# Altium project PV Refridgerator.PrjPCB (part 3 of 3)

## Sheet Vsense Thermistor.SchDoc: Temperature Sensor (Thermistor)
size A4; Date: 2017-07-12; DocumentNumber: 14; Revision: B; SheetNumber: 14; SheetTotal: 16; DesignedBy: Mike MacKay
Used 6 times, as channels Vsense Thermistor, Vsense Thermistor, Vsense Thermistor, Vsense Thermistor, Vsense Thermistor, Vsense Thermistor. Parts and nets are listed once, with the designators drawn on the sheet.
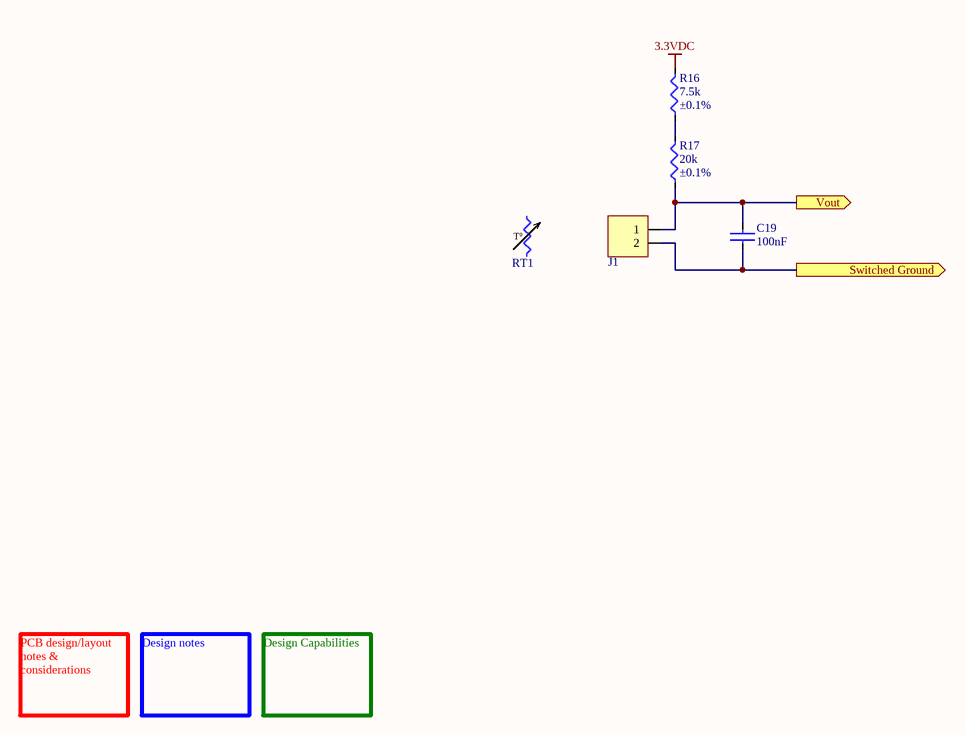
[diagram p16: Vsense Thermistor.SchDoc]

### Parts
C19  Capacitance: 100nF  [C0603 - Ceramic]  (hidden comment: 100nF 0603 50V)
J1  Tº  (value not drawn)
R16  Resistance (Ohms): 7.5k  Tolerance: ±0.1%  [R0603]  (hidden comment: 7.5k 0603 0.1%)
R17  Resistance (Ohms): 20k  Tolerance: ±0.1%  [R0603]  (hidden comment: 20k 0603 0.1%)
RT1  Tº  [Connector - MTA-100 2 Position Friction Lock]  (value not drawn)  (mechanical)

### Ports
Switched Ground (out), Vout (out)

### Nets
3.3VDC: R16.1
Switched Ground: C19.2 J1.2 ; port Switched Ground
Vout: C19.1 J1.1 R17.2 ; port Vout
NetR16_2: R16.2 R17.1

### Channels
Vsense Thermistor: designators end in A; ports Switched Ground=Switched Ground 1 Vout=Vtemp 1
Vsense Thermistor: designators end in B; ports Switched Ground=Switched Ground 2 Vout=Vtemp 2
Vsense Thermistor: designators end in C; ports Switched Ground=Switched Ground 3 Vout=Vtemp 3
Vsense Thermistor: designators end in D; ports Switched Ground=Switched Ground 4 Vout=Vtemp 4
Vsense Thermistor: designators end in E; ports Switched Ground=Switched Ground 5 Vout=Vtemp 5
Vsense Thermistor: designators end in F; ports Switched Ground=Switched Ground 6 Vout=Vtemp 6

### Notes on the sheet
- PCB design/layout notes & considerations
- Design notes
- Design Capabilities
- Repository Version
- BOM/Variant

### Library data of the parts
C19 = 100nF 0603 50V: Manufacturer: Samsung Electro-Mechanics America, Inc; Manufacturer Part Number: CL10B104KB8SFNC; Tolerance: ±10%; Temperature Coefficient: X7R; Value: 100nF 0603 50V; Supplier 1: Digi-Key; RoHS: RoHS Compliant; Category: Capacitors; Stock 1: 1192070; Pricing 1: 1=0.1, 10=0.027, 25=0.0192, 100=0.0125, 500=0.00874, 1000=0.00681 (USD); Packaging: Cut Tape (CT); Voltage - Rated: 50V; Mounting Type: Surface Mount, MLCC; Operating Temperature: -55°C ~ 125°C; Applications: Boardflex Sensitive; Ratings: -; Package / Case: 0603 (1608 Metric); Size / Dimension: 0.063" L x 0.031" W (1.60mm x 0.80mm); Height - Seated (Max): -; Thickness (Max): 0.035" (0.90mm); Lead Spacing: -; Features: Soft Termination; Lead Style: -; ComponentLink1URL: http://www.samsungsem.com/kr/front/downloadcms.do?path=/kr/support/product-search/mlcc/__icsFiles/afieldfile/2014/11/05&fileName=S_CL10B104KB8SFNC.pdf; ComponentLink1Description: http://www.samsungsem.com/kr/front/downloadcms.do?path=/kr/support/product-search/mlcc/__icsFiles/afieldfile/2014/11/05&fileName=S_CL10B104KB8SFNC.pdf; Supplier Part Number 1: 1276-1936-1-ND
J1 = MTA100-2 with friction Lock: Manufacturer: TE Connectivity AMP Connectors; Manufacturer Part Number: 640456-2; Connector Type: Header; Pitch - Mating: 0.100" (2.54mm); Style: Board to Cable/Wire; Shrouding: Shrouded - 1 Wall; Number of Positions: 2; Number of Positions Loaded: All; Contact Length - Mating: 0.295" (7.49mm); Contact Length - Post: 0.140" (3.56mm); Overall Contact Length: 0.535" (13.59mm); Material Flammability Rating: UL94 V-0; Current Rating: Varies by Wire Gauge; Voltage Rating: 250VAC; Value: MTA100-2 with friction Lock; Supplier 1: Digi-Key; Supplier Part Number 1: A1921-ND; RoHS: RoHS Compliant; Category: Connectors, Interconnects; Stock 1: 177276; Pricing 1: 1=0.12, 10=0.117, 50=0.0748, 100=0.0724, 250=0.0624, 500=0.05992, 1000=0.05243, 2500=0.04744 (USD); Packaging: Bulk; Part Status: Active; Operating Temperature: -55°C ~ 105°C; Mounting Type: Through Hole; ComponentLink1URL: http://www.te.com/commerce/DocumentDelivery/DDEController?Action=srchrtrv&DocNm=640456&DocType=Customer+Drawing&DocLang=English; ComponentLink1Description: Spec Sheet; Contact Type: Male Pin; Number of Rows: 1; Row Spacing - Mating: -; Termination: Solder; Fastening Type: Friction Lock; Insulation Height: 0.305" (7.75mm); Contact Shape: Square; Contact Finish - Mating: Tin; Contact Finish Thickness - Mating: -; Contact Finish - Post: Tin; Contact Material: Copper Alloy; Insulation Material: Thermoplastic; Features: -; Ingress Protection: -; Insulation Color: Natural; Mated Stacking Heights: -; Contact Finish Thickness - Post: -; Applications: General Purpose
R16 = 7.5k 0603 0.1%: Resistor; Manufacturer: Yageo; Manufacturer Part Number: RT0603BRD077K5L; Power (Watts): 0.1W, 1/10W; Temperature Coefficient: ±25ppm/°C; Technology: SMT; Value: 7.5k 0603 0.1%; Supplier 1: Digi-Key; Supplier Part Number 1: YAG2311CT-ND; RoHS: RoHS Compliant; Category: Resistors; Stock 1: 15357; Pricing 1: 1=0.32, 10=0.269, 25=0.1952, 50=0.1416, 100=0.105, 250=0.0806, 500=0.0635, 1000=0.04396 (USD); Packaging: Cut Tape (CT); Part Status: Active; Composition: Thin Film; Features: Moisture Resistant; Operating Temperature: -55°C ~ 155°C; Package / Case: 0603 (1608 Metric); Supplier Device Package: 0603; Size / Dimension: 0.063" L x 0.031" W (1.60mm x 0.80mm); Height - Seated (Max): 0.022" (0.55mm); Number of Terminations: 2; Failure Rate: -; ComponentLink1URL: http://www.yageo.com/documents/recent/PYu-RT_1-to-0.05_RoHS_L_7.pdf; ComponentLink1Description: Spec Sheet
R17 = 20k 0603 0.1%: Resistor; Manufacturer: Yageo; Manufacturer Part Number: RT0603BRD0720KL; Power (Watts): 0.1W, 1/10W; Temperature Coefficient: ±25ppm/°C; Technology: SMT; Value: 20k 0603 0.1%; Supplier 1: Digi-Key; Supplier Part Number 1: YAG1582CT-ND; RoHS: RoHS Compliant; Category: Resistors; Stock 1: 24543; Pricing 1: 1=0.35, 10=0.297, 25=0.216, 50=0.1566, 100=0.1161, 250=0.08912, 500=0.0702, 1000=0.0486 (USD); Packaging: Cut Tape (CT); Part Status: Active; Composition: Thin Film; Features: Moisture Resistant; Operating Temperature: -55°C ~ 155°C; Package / Case: 0603 (1608 Metric); Supplier Device Package: 0603; Size / Dimension: 0.063" L x 0.031" W (1.60mm x 0.80mm); Height - Seated (Max): 0.022" (0.55mm); Number of Terminations: 2; Failure Rate: -; ComponentLink1URL: http://www.yageo.com/documents/recent/PYu-RT_1-to-0.05_RoHS_L_7.pdf; ComponentLink1Description: Spec Sheet
RT1 = Thermistor 10k Type J: Resistor; Manufacturer: Murata Electronics North America; Manufacturer Part Number: NXFT15XH103FA2B025; Resistance in Ohms @ 25°C: 10k; Resistance Tolerance: ±1%; B25/50: 3380K; B25/85: 3434K; B25/100: 3455K; Power - Max: 100mW; Value: Thermistor 10k; Supplier 1: Digi-Key; RoHS: RoHS Compliant; Category: Sensors, Transducers; Stock 1: 21226; Pricing 1: 1=0.91, 10=0.752, 25=0.6608, 50=0.549, 100=0.4676, 250=0.42692, 500=0.4066, 1000=0.35578, 2500=0.34053 (USD); Packaging: Bulk; Part Status: Active; Mounting Type: Free Hanging; Operating Temperature: -40°C ~ 125°C; ComponentLink1URL: http://www.murata.com/~/media/webrenewal/support/library/catalog/products/thermistor/ntc/r44e.ashx; ComponentLink1Description: Spec Sheet; Supplier Part Number 1: 490-5628-ND; Technology: THT; B Value Tolerance: ±1%; B0/50: -; B25/75: -; Length - Lead Wire: -; Package / Case: Bead

## Sheet Current Sense.SchDoc: Vsense from 0 to 69.3V
size A4; Date: 2017-02-08; DocumentNumber: 15; Revision: A; SheetNumber: 15; SheetTotal: 16; DesignedBy: Mike MacKay
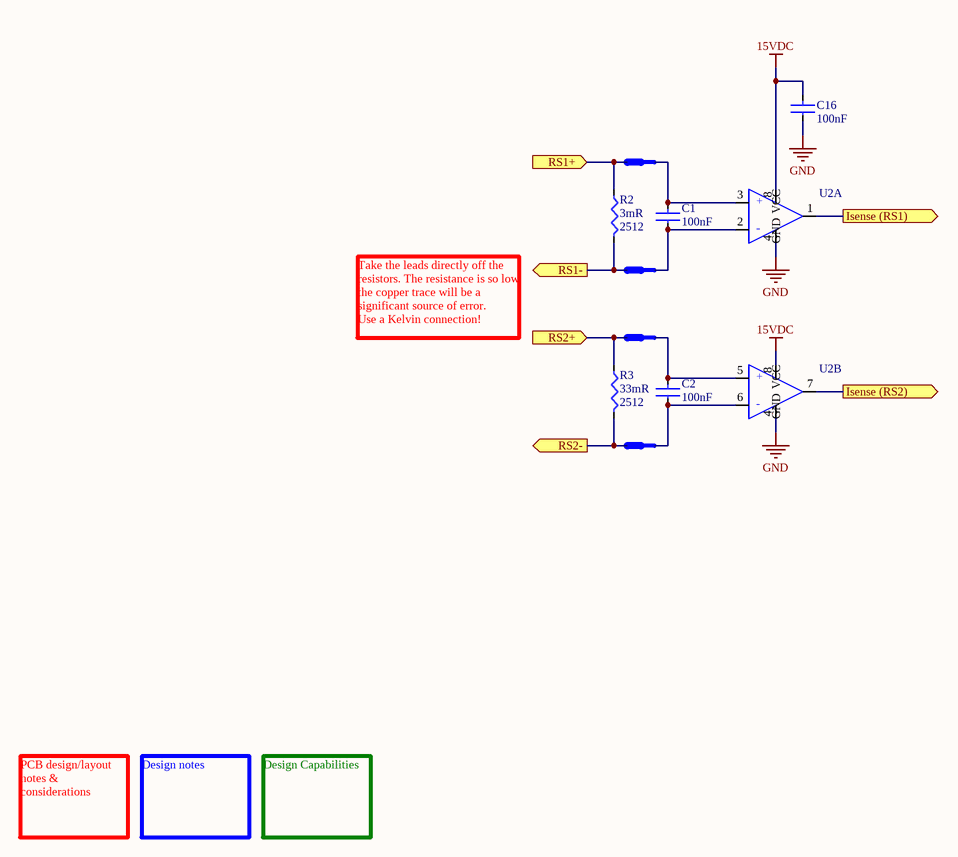
[diagram p17: Current Sense.SchDoc]

### Parts
(Parts that share a designator on the sheet are numbered #1, #2 ... from top to bottom, then left to right.)
C1  Capacitance: 100nF  [C0603 - Ceramic]  (hidden comment: 100nF 0603 50V)
C2  Capacitance: 100nF  [C0603 - Ceramic]  (hidden comment: 100nF 0603 50V)
C16#2  Capacitance: 100nF  [C0603 - Ceramic]  (hidden comment: 100nF 0603 50V)
NetTie3  Net Tie - Different Sizes  (value not drawn)  (net tie, no BOM)
NetTie4  Net Tie - Different Sizes  (value not drawn)  (net tie, no BOM)
NetTie5  Net Tie - Different Sizes  (value not drawn)  (net tie, no BOM)
NetTie6  Net Tie - Different Sizes  (value not drawn)  (net tie, no BOM)
R2  Resistance (Ohms): 3mR  Supplier Device Package: 2512  [R2512]  (hidden comment: 3mR 2512 1%)
R3  Resistance (Ohms): 33mR  Supplier Device Package: 2512  [R2512]  (hidden comment: 33mR 2512 1%)
U2  Dual High Side Current Sense Amplifier  [SOIC-8 (3.9mm)]  (value not drawn)  (parts A,B of 2)

### Ports
Isense (RS1) (out), Isense (RS2) (out), RS1+ (in), RS1- (out), RS2+ (in), RS2- (out)

### Nets
15VDC: C16#2.1 U2.8(VCC)
GND: C16#2.2 U2.4(GND)
HVGND: NetTie6.2 R3.1 ; port RS2-
-Vsolar: NetTie4.2 R2.1 ; port RS1-
Isense (RS1): U2.1(Out) ; port Isense (RS1)
Isense (RS2): U2.7(OUT2) ; port Isense (RS2)
NetC1_1: C1.1 NetTie3.1 U2.3(RS1+)
NetC1_2: C1.2 NetTie4.1 U2.2(RS1-)
NetC2_1: C2.1 NetTie5.1 U2.5(RS2+)
NetC2_2: C2.2 NetTie6.1 U2.6(RS2-)
NetNetTie3_2: NetTie3.2 R2.2 ; port RS1+
NetNetTie5_2: NetTie5.2 R3.2 ; port RS2+

### Notes on the sheet
- Take the leads directly off the resistors. The resistance is so low the copper trace will be a significant source of error.
  Use a Kelvin connection!
- PCB design/layout notes & considerations
- Design notes
- Design Capabilities
- Repository Version
- BOM/Variant
- (in symbol Dual High Side Current Sense Amplifier, part A) +
- (in symbol Dual High Side Current Sense Amplifier, part B) +

### Library data of the parts
C1 C2 C16#2 = 100nF 0603 50V: as C19 on sheet Vsense Thermistor; Value: 100nF 0603 50V; Supplier 1: Digi-Key; RoHS: RoHS Compliant; Category: Capacitors; Stock 1: 1192070; Pricing 1: 1=0.1, 10=0.027, 25=0.0192, 100=0.0125, 500=0.00874, 1000=0.00681 (USD); Packaging: Cut Tape (CT); Voltage - Rated: 50V; Mounting Type: Surface Mount, MLCC; Operating Temperature: -55°C ~ 125°C; Applications: Boardflex Sensitive; Ratings: -; Package / Case: 0603 (1608 Metric); Size / Dimension: 0.063" L x 0.031" W (1.60mm x 0.80mm); Height - Seated (Max): -; Thickness (Max): 0.035" (0.90mm); Lead Spacing: -; Features: Soft Termination; Lead Style: -; ComponentLink1URL: http://www.samsungsem.com/kr/front/downloadcms.do?path=/kr/support/product-search/mlcc/__icsFiles/afieldfile/2014/11/05&fileName=S_CL10B104KB8SFNC.pdf; ComponentLink1Description: http://www.samsungsem.com/kr/front/downloadcms.do?path=/kr/support/product-search/mlcc/__icsFiles/afieldfile/2014/11/05&fileName=S_CL10B104KB8SFNC.pdf; Supplier Part Number 1: 1276-1936-1-ND
NetTie3-NetTie6 = Net Tie - Different Sizes: Ties two nets together
R2 = 3mR 2512 1%: Manufacturer: Yageo; Manufacturer Part Number: PR2512FKF070R003L; Power (Watts): 1W; Temperature Coefficient: ±100ppm/°C; Value: 3mR 2512 1%; Supplier 1: Digi-Key; Supplier Part Number 1: 311-0.003AGCT-ND; RoHS: RoHS Compliant; Category: Resistors; Stock 1: 16866; Pricing 1: 1=0.65, 10=0.544, 25=0.466, 50=0.4196, 100=0.3652, 250=0.32632, 500=0.26416, 1000=0.21366 (USD); Packaging: Cut Tape (CT); Part Status: Active; Tolerance: ±1%; Composition: Thick Film; Features: Current Sense; Operating Temperature: -55°C ~ 170°C; Package / Case: 2512 (6432 Metric); Size / Dimension: 0.252" L x 0.126" W (6.40mm x 3.20mm); Height - Seated (Max): 0.041" (1.03mm); Number of Terminations: 2; Failure Rate: -; ComponentLink1URL: http://www.yageo.com/NewPortal/yageodocoutput?fileName=/pdf/R-Chip/-PYu-PR_51_RoHS_Z_0.pdf; ComponentLink1Description: Spec Sheet
R3 = 33mR 2512 1%: Manufacturer: Yageo; Manufacturer Part Number: RL2512FK-070R033L; Power (Watts): 1W; Temperature Coefficient: ±1200ppm/°C; Value: 3mR 2512 1%; Supplier 1: Digi-Key; Supplier Part Number 1: 311-.033TCT-ND; RoHS: RoHS Compliant; Category: Resistors; Stock 1: 13739; Pricing 1: 1=0.61, 10=0.453, 25=0.3676, 50=0.3196, 100=0.2636, 250=0.229, 500=0.1864, 1000=0.14784 (USD); Packaging: Cut Tape (CT); Part Status: Active; Tolerance: ±1%; Composition: Thick Film; Features: Automotive AEC-Q200, Current Sense, Moisture Resistant; Operating Temperature: -55°C ~ 155°C; Package / Case: 2512 (6432 Metric); Size / Dimension: 0.250" L x 0.126" W (6.35mm x 3.20mm); Height - Seated (Max): 0.026" (0.65mm); Number of Terminations: 2; Failure Rate: -; ComponentLink1URL: http://www.yageo.com/documents/recent/PYu-RL_Group_521_RoHS_L%201.pdf; ComponentLink1Description: http://www.yageo.com/documents/recent/PYu-RL_Group_521_RoHS_L%201.pdf
U2 = Dual High Side Current Sense Amplifier: Manufacturer: Maxim Integrated; Manufacturer Part Number: MAX4377FASA+; Number of Circuits: 2; Slew Rate: 10 V/µs; -3db Bandwidth: 1.7MHz; Current - Input Bias: 800µA; Current - Supply: 1mA; Voltage - Supply, Single/Dual (±): 3 V ~ 28 V; Supplier 1: Digi-Key; RoHS: RoHS Compliant; Category: Integrated Circuits (ICs); Stock 1: 695; Pricing 1: 1=1.98, 10=1.881, 50=1.8742 (USD); Packaging: Tube; Part Status: Active; Amplifier Type: Current Sense; Output Type: -; Gain Bandwidth Product: -; Voltage - Input Offset: -; Current - Output / Channel: -; Operating Temperature: -40°C ~ 125°C; Mounting Type: Surface Mount; Package / Case: 8-SOIC (0.154", 3.90mm Width); Supplier Device Package: 8-SOIC; ComponentLink1URL: https://datasheets.maximintegrated.com/en/ds/MAX4376-MAX4378.pdf; ComponentLink1Description: Spec Sheet; Supplier Part Number 1: MAX4377FASA+-ND

## Sheet Reverse Voltage Protection.SchDoc: Title
size A4; Revision: A; DesignedBy: Craig Comberbach
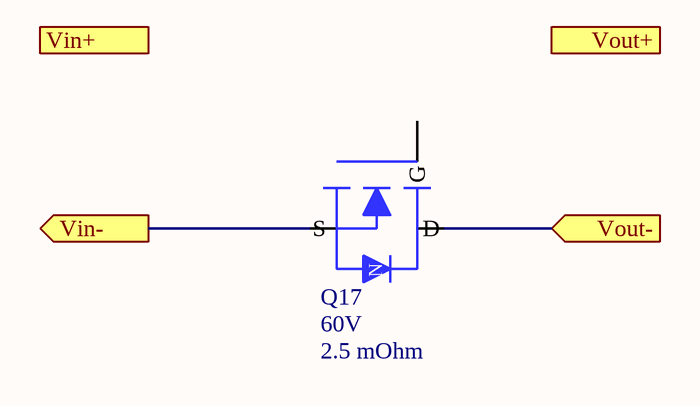
[diagram p18: Reverse Voltage Protection.SchDoc]

### Parts
Q17  Drain to Source Voltage (Vdss): 60V  Rds On (Max) @ Id, Vgs: 2.5 mOhm  [DPAK]  (hidden comment: N-MOSFET)

### Ports
Vin+ (in), Vin- (out), Vout+ (out), Vout- (in)

### Nets
NetQ17_2: Q17.2(D) ; port Vout-
NetQ17_3: Q17.3(S) ; port Vin-

Not connected (* = marked no-connect by the designer): Q17 1(G)

### Notes on the sheet
- Repository Version
- BOM/Variant
- (in symbol N-MOSFET 2.5mR 60V) N

### Library data of the parts
Q17 = N-MOSFET 2.5mR 60V: Manufacturer: Infineon Technologies; Manufacturer Part Number: IPD025N06N; FET Type: N-Channel; Current - Continuous Drain (Id) @ 25°C: 90A; Drive Voltage (Max Rds On,  Min Rds On): 6V, 10V; Vgs(th) (Max) @ Id: 2.8V @ 95µA; Gate Charge (Qg) (Max) @ Vgs: 71nC @ 10V; Input Capacitance (Ciss) (Max) @ Vds: 5200pF @ 30V; Vgs (Max): ±20V; Power Dissipation (Max): 3W (Ta), 167W (Tc); Supplier 1: Digi-Key; Supplier Part Number 1: IPD025N06NCT-ND; RoHS: RoHS Compliant; Category: Discrete Semiconductor Products; Stock 1: 5405; Pricing 1: 1=1.91, 10=1.72, 100=1.3822, 500=1.13558, 1000=0.94091 (USD); Packaging: Cut Tape (CT); Part Status: Active; Technology: MOSFET (Metal Oxide); FET Feature: -; Operating Temperature: -55°C ~ 175°C (TJ); Mounting Type: Surface Mount; Supplier Device Package: PG-TO252-3; Package / Case: TO-252-3, DPak (2 Leads + Tab), SC-63; ComponentLink1URL: http://www.infineon.com/dgdl/IPD025N06N_Rev2+1.pdf?folderId=db3a304313b8b5a60113cee8763b02d7&fileId=db3a304336415dec0136531648062c76; ComponentLink1Description: Spec Sheet; Value: N-MOSFET 2.5mR

## Nets that join several sheets
3.3VDC: High Current H-Bridge/Emergency Thermal Shutdown (D10A.1 R22A.2 Rt3A.2 U4A.5), High Voltage H-Bridge/Emergency Thermal Shutdown (D10B.1 R22B.2 Rt3B.2 U4B.5), 3.3VDC 250mA Linear PS (C12.1 U5.3), Microcontroller (9 pins), ICSP (J5.2 R4.1), Vsense Thermistor (R16A.1), Vsense Thermistor (R16B.1), Vsense Thermistor (R16C.1), Vsense Thermistor (R16D.1), Vsense Thermistor (R16E.1), Vsense Thermistor (R16F.1)
15VDC: High Current H-Bridge/Half H-Bridge Driver (C9A.1 C13A.1 D8A.1 U6A.5), High Current H-Bridge/Half H-Bridge Driver (C9B.1 C13B.1 D8B.1 U6B.5), High Voltage H-Bridge/Half H-Bridge Driver (C9C.1 C13C.1 D8C.1 U6C.5), High Voltage H-Bridge/Half H-Bridge Driver (C9D.1 C13D.1 D8D.1 U6D.5), 15VDC 500mA Boost SMPS (C16#1.2 C20.1 D9.2 R20#1.2), Current Sense (C16#2.1 U2.8)
GND: High Current H-Bridge/Half H-Bridge Driver (C9A.2 C13A.2 U6A.3), High Current H-Bridge/Half H-Bridge Driver (C9B.2 C13B.2 U6B.3), High Current H-Bridge/Emergency Thermal Shutdown (D11A.2 R23A.1 Rb2A.2 U4A.2), High Voltage H-Bridge/Half H-Bridge Driver (C9C.2 C13C.2 U6C.3), High Voltage H-Bridge/Half H-Bridge Driver (C9D.2 C13D.2 U6D.3), High Voltage H-Bridge/Emergency Thermal Shutdown (D11B.2 R23B.1 Rb2B.2 U4B.2), Powersupply (NetTie2.2 NetTie10.1), 15VDC 500mA Boost SMPS (8 pins), 3.3VDC 250mA Linear PS (5 pins), 5VDC 250mA Buck SMPS (13 pins), Microcontroller (9 pins), ICSP (C14.2 J5.3), RGB LED (R8.1 R9.1 R10.1), Vsense 0-69.3V (C17A.2 R20A.1), Current Sense (C16#2.2 U2.4), Vsense (0-69.3V) (C17B.2 R20B.1), Vsense 0-69.3V (C17C.2 R20C.1)
HVGND: Full-Wave Rectifier (5 pins), Powersupply (NetTie2.1), Vsense 0-223 (C18A.2 R15A.1), Current Sense (NetTie6.2 R3.1), Vsense 0-223 (C18B.2 R15B.1), Vsense 0-223 (C18C.2 R15C.1)
+DC Bus: Full-Wave Rectifier (5 pins), High Voltage H-Bridge (Q5.2 Q6.2 Q13.2 Q14.2)
+Vsolar: Overview (J3.1 NetTie7.1), High Current H-Bridge (Q1.2 Q2.2 Q9.2 Q10.2), Powersupply (C25.1 C26.1 C27.1 D?.1)
+VT1.P: Overview (NetTie8.1), High Current H-Bridge (Q1.3 Q3.2 Q9.3 Q11.2), High Current H-Bridge/Half H-Bridge Driver (NetTie1A.1), Transformer (J7.2 T1.8 T1.12)
+VT1.S: Full-Wave Rectifier (D1#1.1 D3.2), Transformer (J8.2 T1.6), Vsense 0-223 (R14A.1)
-Vsolar: Overview (J3.2), Powersupply (C25.2 C26.2 C27.2 NetTie10.2), Current Sense (NetTie4.2 R2.1)
-VT1.P: Overview (NetTie9.1), High Current H-Bridge (Q2.3 Q4.2 Q10.3 Q12.2), High Current H-Bridge/Half H-Bridge Driver (NetTie1B.1), Transformer (J7.1 T1.7 T1.11)
A_HO: High Current H-Bridge (Q1.1 Q9.1), High Current H-Bridge/Half H-Bridge Driver (R12A.2)
A_LO: High Current H-Bridge (Q3.1 Q11.1), High Current H-Bridge/Half H-Bridge Driver (R13A.2)
B_HO: High Current H-Bridge (Q2.1 Q10.1), High Current H-Bridge/Half H-Bridge Driver (R12B.2)
B_LO: High Current H-Bridge (Q4.1 Q12.1), High Current H-Bridge/Half H-Bridge Driver (R13B.2)
C_HO: High Voltage H-Bridge (Q5.1 Q13.1), High Voltage H-Bridge/Half H-Bridge Driver (R12C.2)
C_LO: High Voltage H-Bridge (Q7.1 Q15.1), High Voltage H-Bridge/Half H-Bridge Driver (R13C.2)
C_VS: Overview (J6.1), High Voltage H-Bridge (Q5.3 Q7.2 Q13.3 Q15.2), High Voltage H-Bridge/Half H-Bridge Driver (NetTie1C.1), Vsense 0-223 (R14B.1)
D_HO: High Voltage H-Bridge (Q6.1 Q14.1), High Voltage H-Bridge/Half H-Bridge Driver (R12D.2)
D_LO: High Voltage H-Bridge (Q8.1 Q16.1), High Voltage H-Bridge/Half H-Bridge Driver (R13D.2)
D_VS: Overview (J6.2), High Voltage H-Bridge (Q6.3 Q8.2 Q14.3 Q16.2), High Voltage H-Bridge/Half H-Bridge Driver (NetTie1D.1), Vsense 0-223 (R14C.1)
Isense (RS1): Microcontroller (U1#2.22), Current Sense (U2.1)
Isense (RS2): Microcontroller (U1#2.23), Current Sense (U2.7)
MCLR: Microcontroller (U1#2.7), ICSP (R5.2)
NetC3_1: Powersupply (D?.2), 5VDC 250mA Buck SMPS (C3.1 U1#1.7)
NetD2_1: Full-Wave Rectifier (D2.1 D4.2), Transformer (J8.1 T1.1)
NetD5_1: Microcontroller (U1#2.43), RGB LED (D5.1)
NetD6_1: Microcontroller (U1#2.44), RGB LED (D6.1)
NetD7_1: Microcontroller (U1#2.45), RGB LED (D7.1)
NetNetTie3_2: High Current H-Bridge (Q3.3 Q4.3 Q11.3 Q12.3), Current Sense (NetTie3.2 R2.2)
NetNetTie5_2: High Voltage H-Bridge (Q7.3 Q8.3 Q15.3 Q16.3), Current Sense (NetTie5.2 R3.2)
NetNetTie7_2: Overview (NetTie7.2), Vsense (0-69.3V) (R11B.1)
NetNetTie8_2: Overview (NetTie8.2), Vsense 0-69.3V (R11A.1)
NetNetTie9_2: Overview (NetTie9.2), Vsense 0-69.3V (R11C.1)
NetU1#2_31: High Voltage H-Bridge/Half H-Bridge Driver (U6C.2), Microcontroller (U1#2.31)
NetU1#2_32: High Voltage H-Bridge/Half H-Bridge Driver (U6D.2), Microcontroller (U1#2.32)
NetU1#2_33: High Voltage H-Bridge/Half H-Bridge Driver (U6C.1), Microcontroller (U1#2.33)
NetU1#2_34: High Voltage H-Bridge/Half H-Bridge Driver (U6D.1), Microcontroller (U1#2.34)
NetU1#2_42: High Current H-Bridge/Half H-Bridge Driver (U6A.1), Microcontroller (U1#2.42)
NetU1#2_46: High Current H-Bridge/Half H-Bridge Driver (U6B.1), Microcontroller (U1#2.46)
NetU1#2_52: High Current H-Bridge/Half H-Bridge Driver (U6B.2), Microcontroller (U1#2.52)
NetU1#2_53: High Current H-Bridge/Half H-Bridge Driver (U6A.2), Microcontroller (U1#2.53)
PGC: Microcontroller (U1#2.11), ICSP (R7.2)
PGD: Microcontroller (U1#2.12), ICSP (R6.2)
Switched Ground 1: Microcontroller (U1#2.4), Vsense Thermistor (C19A.2 J1A.2)
Switched Ground 2: Microcontroller (U1#2.5), Vsense Thermistor (C19B.2 J1B.2)
Switched Ground 3: Microcontroller (U1#2.3), Vsense Thermistor (C19C.2 J1C.2)
Switched Ground 4: Microcontroller (U1#2.2), Vsense Thermistor (C19D.2 J1D.2)
Switched Ground 5: Microcontroller (U1#2.1), Vsense Thermistor (C19E.2 J1E.2)
Switched Ground 6: Microcontroller (U1#2.6), Vsense Thermistor (C19F.2 J1F.2)
Vsense (+T1 S): Microcontroller (U1#2.28), Vsense 0-223 (C18A.1 R14A.2 R15A.2)
Vsense (+T1.P): Microcontroller (U1#2.15), Vsense 0-69.3V (C17A.1 R11A.2 R20A.2)
Vsense (+Vout): Microcontroller (U1#2.29), Vsense 0-223 (C18B.1 R14B.2 R15B.2)
Vsense (+Vsolar): Microcontroller (U1#2.14), Vsense (0-69.3V) (C17B.1 R11B.2 R20B.2)
Vsense (-T1.P): Microcontroller (U1#2.16), Vsense 0-69.3V (C17C.1 R11C.2 R20C.2)
Vsense (-Vout): Microcontroller (U1#2.30), Vsense 0-223 (C18C.1 R14C.2 R15C.2)
Vtemp 1: Microcontroller (U1#2.17), Vsense Thermistor (C19A.1 J1A.1 R17A.2)
Vtemp 2: Microcontroller (U1#2.13), Vsense Thermistor (C19B.1 J1B.1 R17B.2)
Vtemp 3: Microcontroller (U1#2.18), Vsense Thermistor (C19C.1 J1C.1 R17C.2)
Vtemp 4: Microcontroller (U1#2.21), Vsense Thermistor (C19D.1 J1D.1 R17D.2)
Vtemp 5: Microcontroller (U1#2.24), Vsense Thermistor (C19E.1 J1E.1 R17E.2)
Vtemp 6: Microcontroller (U1#2.27), Vsense Thermistor (C19F.1 J1F.1 R17F.2)